# Altium schematic sheet Top.SchDoc
size A
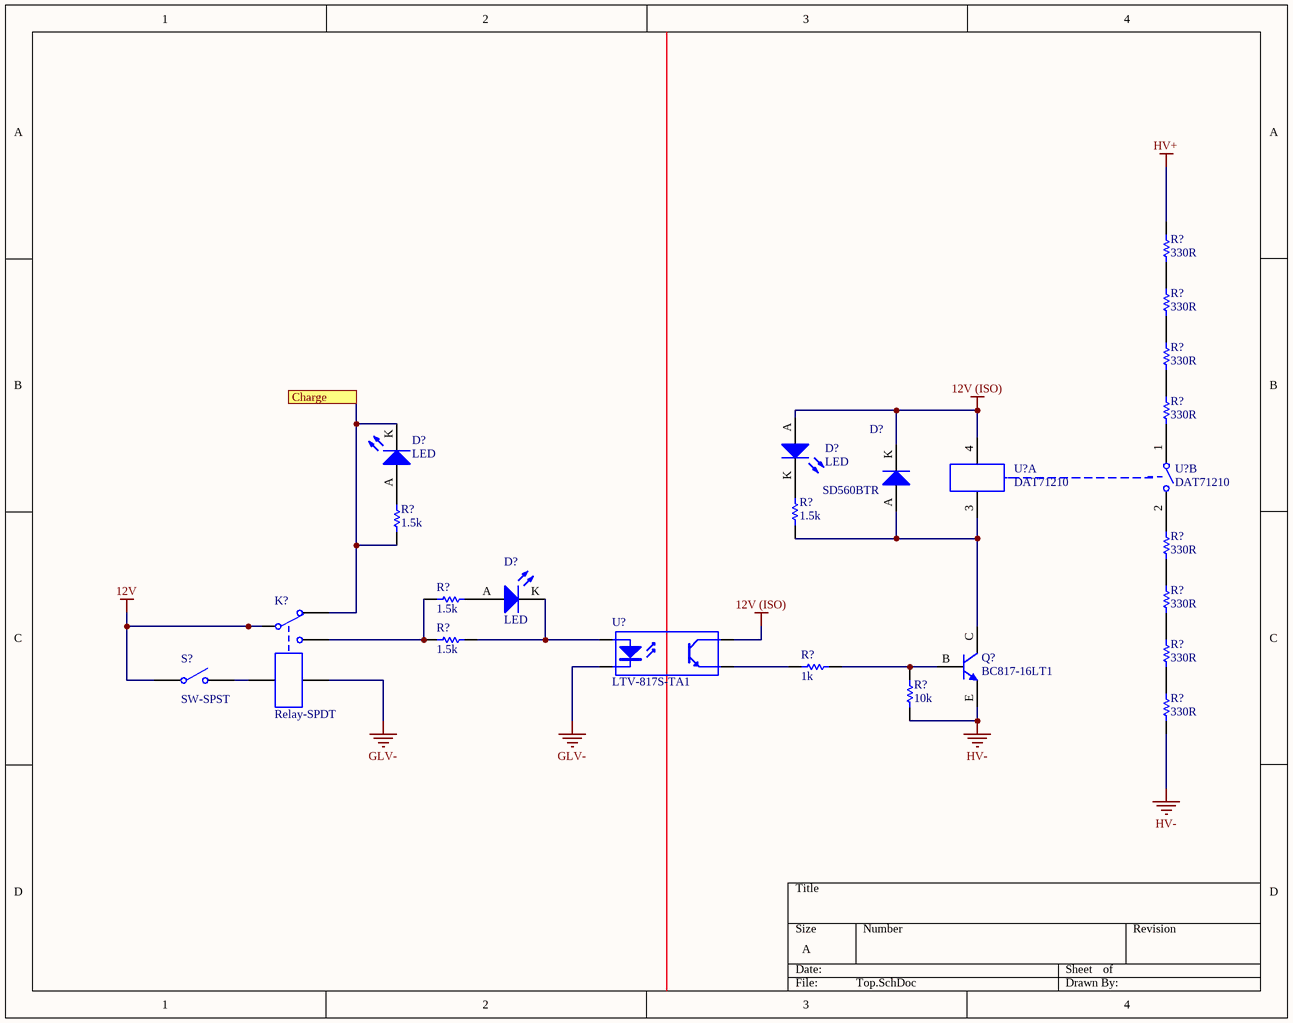
[diagram p0: Top.SchDoc]

## Parts
(Parts that share a designator on the sheet are numbered #1, #2 ... from top to bottom, then left to right.)
D?#1  LED  [0805 LED]
D?#2  LED  [0805 LED]
D?#3  SD560BTR  [SMB Diode]
D?#4  LED  [0805 LED]
K?  Relay-SPDT  [MODULE5B]
Q?  BC817-16LT1  [ON SOT-23 BJT]
R?#1  330R  [B TO-263]
R?#2  330R  [B TO-263]
R?#3  330R  [B TO-263]
R?#4  330R  [B TO-263]
R?#5  1.5k  [0805]
R?#6  1.5k  [0805]
R?#7  330R  [B TO-263]
R?#8  1.5k  [0805]
R?#9  330R  [B TO-263]
R?#10  1.5k  [0805]
R?#11  1k  [0805]
R?#12  330R  [B TO-263]
R?#13  10k  [0805]
R?#14  330R  [B TO-263]
S?  SW-SPST  [SPST-2]
U?#1  DAT71210  [C3 SPST]  (part A of 2)
U?#2  DAT71210  [C3 SPST]  (part B of 2)
U?#3  LTV-817S-TA1  [ON 4-SMD]

## Ports
Charge

## Nets
12V: K?.1 S?.1(COMMON)
12V (ISO): D?#1.A D?#3.K U?#1.4 U?#3.4(C)
GLV-: K?.5 U?#3.2(K)
HV+: R?#1.2
HV-: Q?.E R?#13.1 R?#14.1
Charge: D?#2.K K?.2 R?#6.2 ; port Charge
NetD?#1_K: D?#1.K R?#5.1
NetD?#2_A: D?#2.A R?#6.1
NetD?#3_A: D?#3.A Q?.C R?#5.2 U?#1.3
NetD?#4_A: D?#4.A R?#8.1
NetD?#4_K: D?#4.K R?#10.1 U?#3.1(A)
NetK?_3: K?.3 R?#8.2 R?#10.2
NetK?_4: K?.4 S?.2(NO)
NetQ?_B: Q?.B R?#11.2 R?#13.2
NetR?#1_1: R?#1.1 R?#2.2
NetR?#2_1: R?#2.1 R?#3.2
NetR?#3_1: R?#3.1 R?#4.2
NetR?#7_1: R?#7.1 R?#9.2
NetR?#7_2: R?#7.2 U?#2.2
NetR?#9_1: R?#9.1 R?#12.2
NetR?#11_1: R?#11.1 U?#3.3(E)
NetR?#12_1: R?#12.1 R?#14.2

Not connected (* = marked no-connect by the designer): R?#4 1; U?#2 1

## Library data of the parts
D?#1 D?#2 D?#4 = SML-210LTT86: Red LED Indication - Discrete 1.75V 0805 (2012 Metric); Manufacturer: ROHM Semiconductor; Part Number: SML-210LTT86; Colour: Red; Digikey Part Number: 511-1286-1-ND; Digikey Link: https://www.digikey.com/product-detail/en/rohm-semiconductor/SML-210LTT86/511-1286-1-ND/637099
D?#3 = SD560BTR: 1.2V_F 600V 5A SMB; Manufacturer: SMC Diode Solutions; Part Number: SD560BTR; Digikey Part Number: 1655-1530-2-ND; Digikey Link: https://www.digikey.com/product-detail/en/smc-diode-solutions/SD560BTR/1655-1530-2-ND/6022620
K? = Relay-SPDT: Single-Pole Dual-Throw Relay; Published: 24-Mar-1999; LatestRevisionDate: 17-Jul-2002; LatestRevisionNote: Re-released for DXP Platform.; PackageReference: MODULE5B; Publisher: Altium Limited
Q? = BC817-16LT1: 300mW  BJT NPN Transistor; Manufacturer: ON Semiconductor; Part Number: BC817-16LT1; Digikey Part Number: BC817-16LT1OSTR-ND; Digikey Link: https://www.digikey.com.au/product-detail/en/on-semiconductor/BC817-16LT1/BC817-16LT1OSTR-ND/606178
R?#1-R?#4 R?#7 R?#9 R?#12 R?#14 = PWR263S-35-3300JE: Manufacturer: Bournes Inc; Tolerance: 0.05; Rated Voltage: 35W; Value: 330R; Part Number: PWR263S-35-3300JE; Digikey Part Number: PWR263S-35-3300J-ND
R?#5 R?#6 R?#8 R?#10 = RC0805FR071K5L: Manufacturer: YAGEO; Tolerance: 0.01; Rated Voltage: 0.125W; Part Number: RC0805FR071K5L; Value: 1.5k; Material: FR-07; qty: 50
R?#11 = RC0805FR071KL: Manufacturer: YAGEO; Tolerance: 0.01; Rated Voltage: 0.125W; Part Number: RC0805FR071KL; Value: 1k; Material: FR-07; Digikey Part Number: 311-1.00KCRCT-ND
R?#13 = RC0805FR0710KL: Manufacturer: YAGEO; Tolerance: 0.01; Rated Voltage: 0.125W; Part Number: RC0805FR0710KL; Value: 10k; Material: FR-07; Digikey Part Number: 311-10.0KCRCT-ND
S? = SW-SPST: Single-Pole, Single-Throw Switch; Published: 24-Mar-1999; LatestRevisionDate: 17-Jul-2002; LatestRevisionNote: Re-released for DXP Platform.; PackageReference: SPST-2; Publisher: Altium Limited; PackageDescription: Switch; 2 Leads
U?#1 U?#2 = DAT71210: RELAY REED SPST-NO 2A 12V; Manufacturer: Cynergy 3; Part Number: DAT71210; Digikey Part Number: 725-1030-ND; Digikey Link: https://www.digikey.com.au/product-detail/en/cynergy-3/DAT71210/725-1030-ND/752005
U?#3 = LTV-817S-TA1: 35V 50ma Optocoupler (VF=1.2V); Manufacturer: Lite-On Inc; Part Number: LTV-817S-TA1; Digikey Part Number: 160-1893-2-ND; Digikey Link: https://www.digikey.com/product-detail/en/lite-on-inc/LTV-817S-TA1/160-1893-2-ND/388451